# Altium project ATmega4809_Curiosity_Nano.PrjPcb
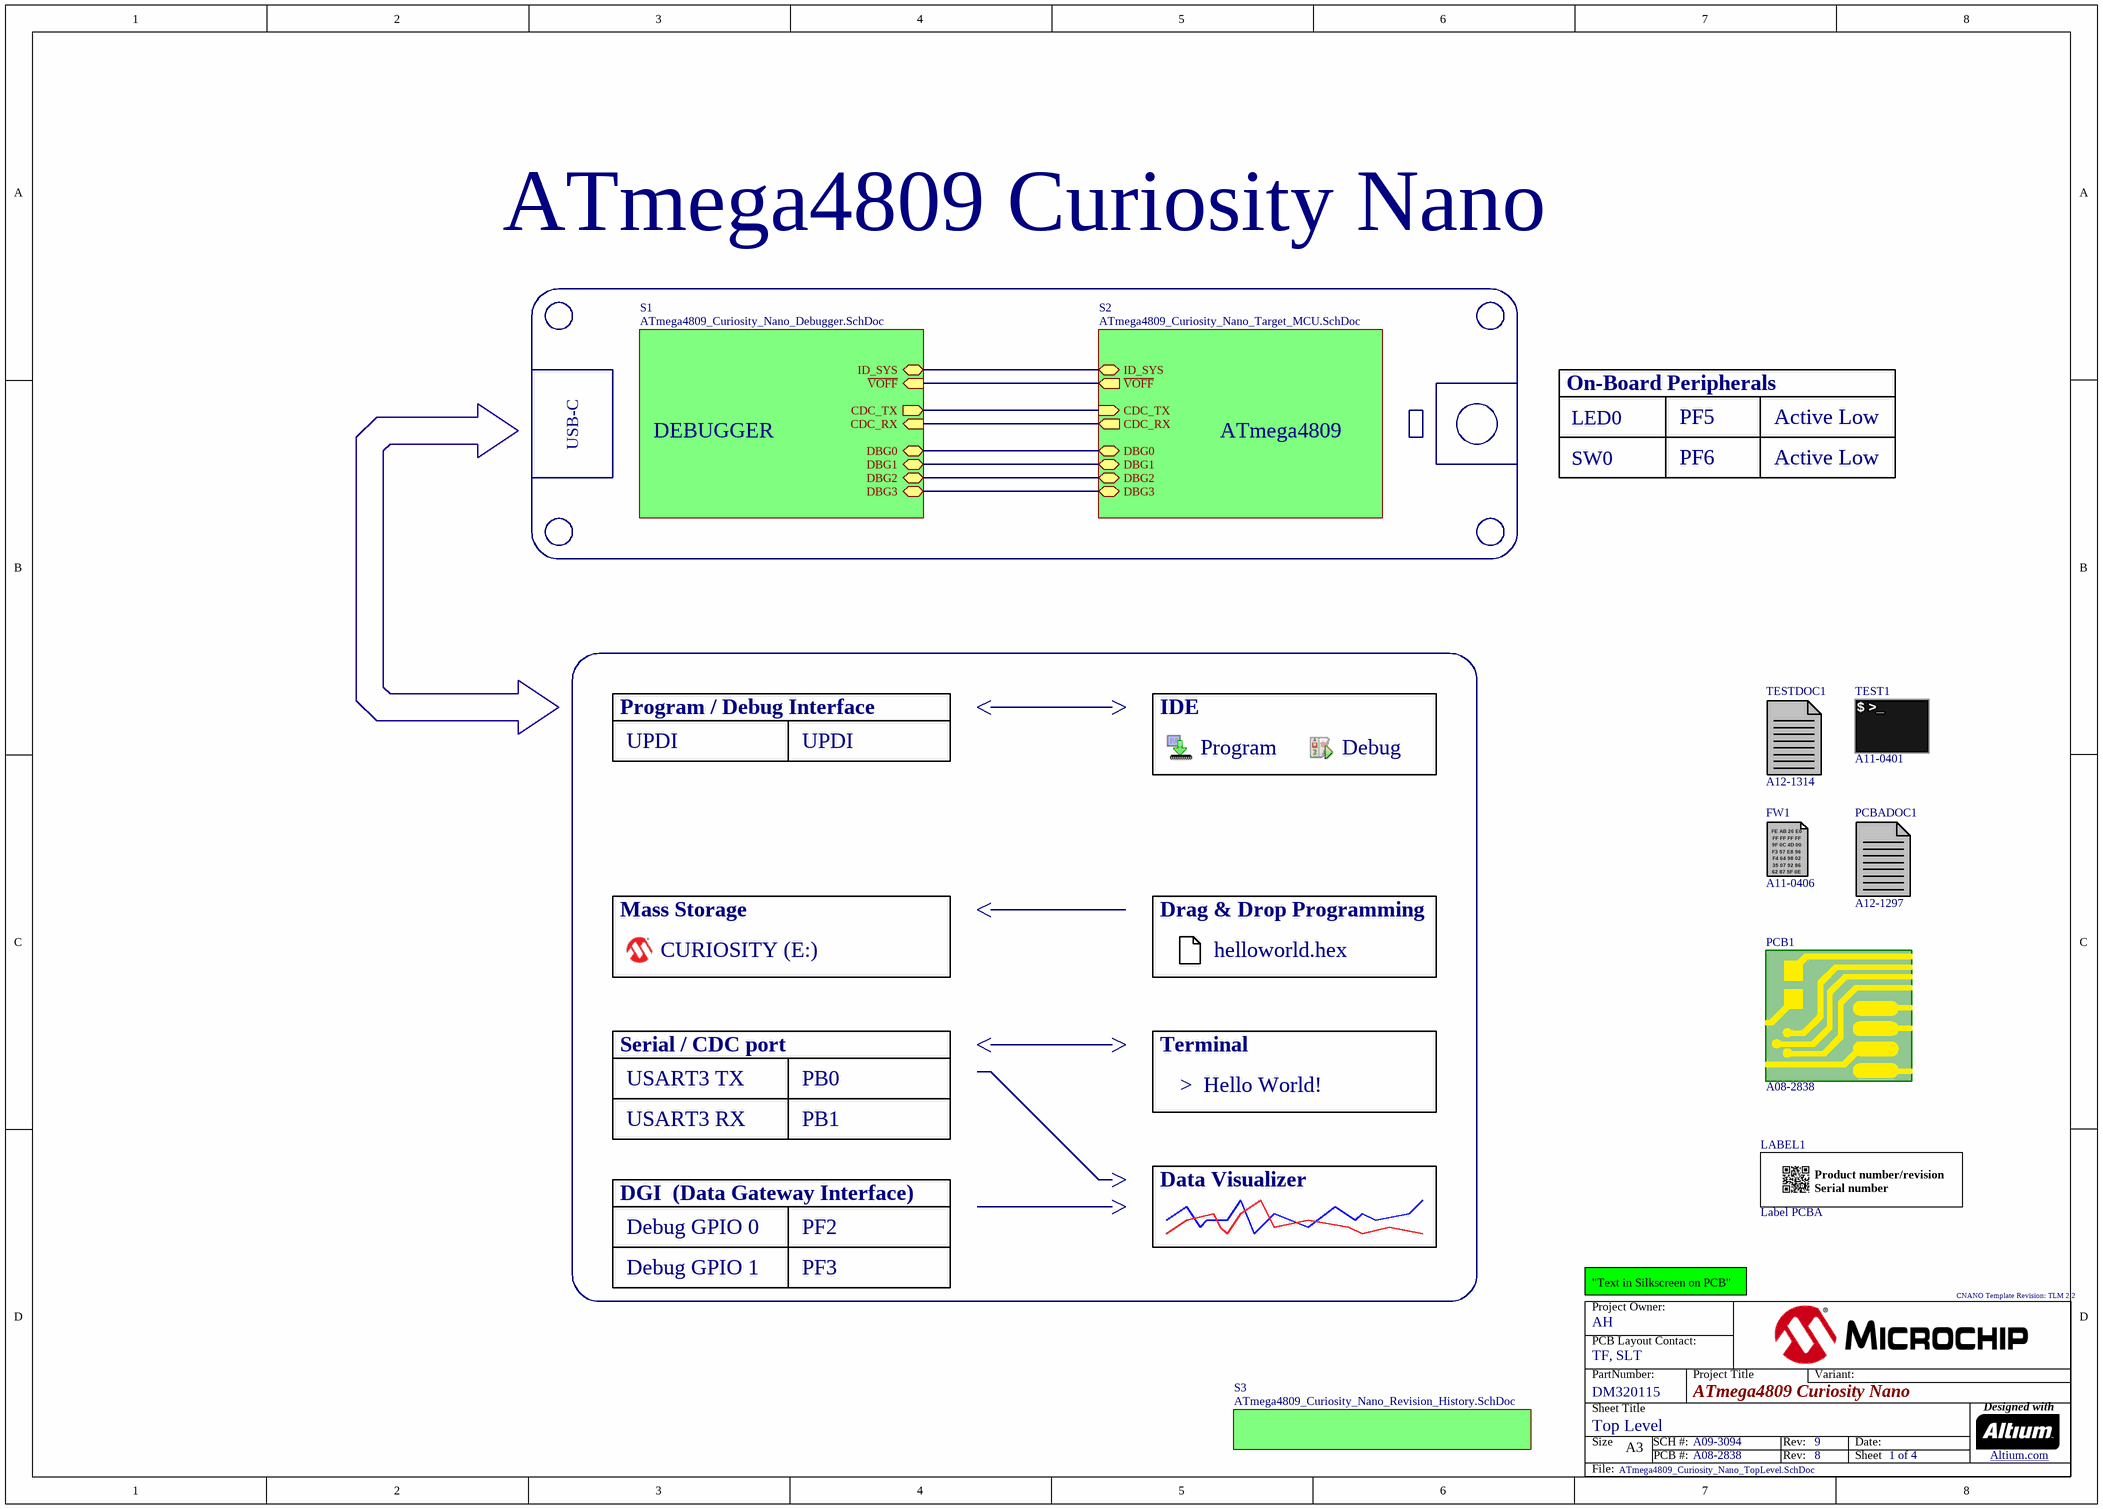
[diagram p0: ATmega4809_Curiosity_Nano_TopLevel.SchDoc]
CNANO_Template_Revision: TLM 2.2; OutjobTitle: ATmega4809-Curiosity-Nano; ProjectContactOwner: AH; ProjectContactPCB: TF, SLT; ProjectPartNumber: DM320115; ProjectPCBAssyNumber: A09-3094; ProjectPCBAssyRevision: 9; ProjectPCBFabNumber: A08-2838; ProjectPCBFabRevision: 8; ProjectTargetName: ATmega4809; ProjectTitle: ATmega4809 Curiosity Nano
4 sheets, 82 parts. Net scope: hierarchical (ports join the sheet entries above them; power ports are global).
Board file: ATmega4809_Curiosity_Nano.PcbDoc
Sheets:
  ATmega4809_Curiosity_Nano_TopLevel.SchDoc
    S2 = ATmega4809_Curiosity_Nano_Target_MCU.SchDoc
    S1 = ATmega4809_Curiosity_Nano_Debugger.SchDoc
    S3 = ATmega4809_Curiosity_Nano_Revision_History.SchDoc

## Sheet ATmega4809_Curiosity_Nano_TopLevel.SchDoc
size A3; SheetTitle: Top Level; CompanyName: Microchip Technology Inc.; Organization: Microchip Technology; Address1: 2355 West Chandler Blvd.; Address2: Chandler, AZ  85224; Address4: USA; SheetNumber: 1; SheetTotal: 4; Time: Time

### Parts
FW1  AN: A11-0406  (mechanical)
LABEL1  value Label PCBA  [AP8-00317]
PCB1  AN: A08-2838  (mechanical)
PCBADOC1  AN: A12-1297  (mechanical)
TEST1  AN: A11-0401  (mechanical)
TESTDOC1  AN: A12-1314  (mechanical)

### Sub-sheets
S1 = ATmega4809_Curiosity_Nano_Debugger.SchDoc: DBG2 (bidir), DBG1 (bidir), DBG3 (bidir), DBG0 (bidir), ~{VOFF} (in), ID_SYS (bidir), CDC_RX (in), CDC_TX (out)
S2 = ATmega4809_Curiosity_Nano_Target_MCU.SchDoc: DBG0 (bidir), DBG1 (bidir), DBG3 (bidir), DBG2 (bidir), ~{VOFF} (out), ID_SYS (bidir), CDC_RX (out), CDC_TX (in)
S3 = ATmega4809_Curiosity_Nano_Revision_History.SchDoc: no entries

### Nets
CDC_RX: sheet S2/CDC_RX, sheet S1/CDC_RX
CDC_TX: sheet S2/CDC_TX, sheet S1/CDC_TX
DBG0: sheet S2/DBG0, sheet S1/DBG0
DBG1: sheet S2/DBG1, sheet S1/DBG1
DBG2: sheet S2/DBG2, sheet S1/DBG2
DBG3: sheet S2/DBG3, sheet S1/DBG3
ID_SYS: sheet S2/ID_SYS, sheet S1/ID_SYS
~{VOFF}: sheet S2/~{VOFF}, sheet S1/~{VOFF}

### Notes on the sheet
- USB-C
- DEBUGGER
- On-Board Peripherals
- LED0
- PF5
- Active Low
- SW0
- PF6
- Program / Debug Interface
- IDE
- UPDI
- Program
- Debug
- Mass Storage
- Drag & Drop Programming
- CURIOSITY (E:)
- helloworld.hex
- Serial / CDC port
- Terminal
- USART3 TX
- USART3 RX
- PB1
- PB0
- >  Hello World!
- Data Visualizer
- DGI  (Data Gateway Interface)
- Debug GPIO 0
- PF2
- Debug GPIO 1
- PF3
- "Text in Silkscreen on PCB"
- Project Owner:
- PCB Layout Contact:
- PartNumber:
- Project Title
- Variant:
- Sheet Title
- Size
- A3
- SCH #:
- PCB #:
- Rev:
- Date:
- Sheet
- Designed with
- Altium.com <http://go.altium.com/MicrochipLandingPage_Evaluation.html>
- File:
- (in symbol A09-0611) / Product number/revision / Serial number
- (in symbol A11-0401) $ >_
- (in symbol A11-0406) FE AB 26 E0; FF FF FF FF; 9F 0C 4D 00; F3 57 E8 96; F4 64 98 02; 35 07 92 86; 62 87 5F 0E

### Library data of the parts
FW1 = A11-0406: nEDBG firmware; PartGroup: Software,Firmware,Tools; Value: nEDBG firmware
LABEL1 = A09-0611: PCBA identification label PP Top White Gloss; Manufacturer: ACT Logimark AS; MPN: 505462; PartGroup: Mechanical devices,Packaging materials,Printed Labels,PCBA; AN: A09-0611
PCB1 = A08-2838: ATmega4809 Curiosity Nano PCB documentation; PartGroup: Mechanical devices,Printed circuit boards; Value: ATmega4809 Curiosity Nano PCB documentation
PCBADOC1 = A12-1297: ATmega4809 Curiosity Nano PCBA documentation; PartGroup: Documentation,PCBA Documents,Atmel; Value: A09-3094 PCBA files
TEST1 = A11-0401: Fixture test for ATmega4809 Curiosity Nano; PartGroup: Software,Test software,Starter Kit; Value: ATmega4809 Curiosity Nano test
TESTDOC1 = A12-1314: Generic Test Instructions for Curiosity Nano; PartGroup: Documentation,Procedures,Test Instructions; Value: Curiosity Nano Test Instructions

## Sheet ATmega4809_Curiosity_Nano_Target_MCU.SchDoc
size A3; SheetTitle: Target MCU; CompanyName: Microchip Technology Inc.; Organization: Microchip Technology; Address1: 2355 West Chandler Blvd.; Address2: Chandler, AZ  85224; Address4: USA; SheetNumber: 2; SheetTotal: 4; Time: Time
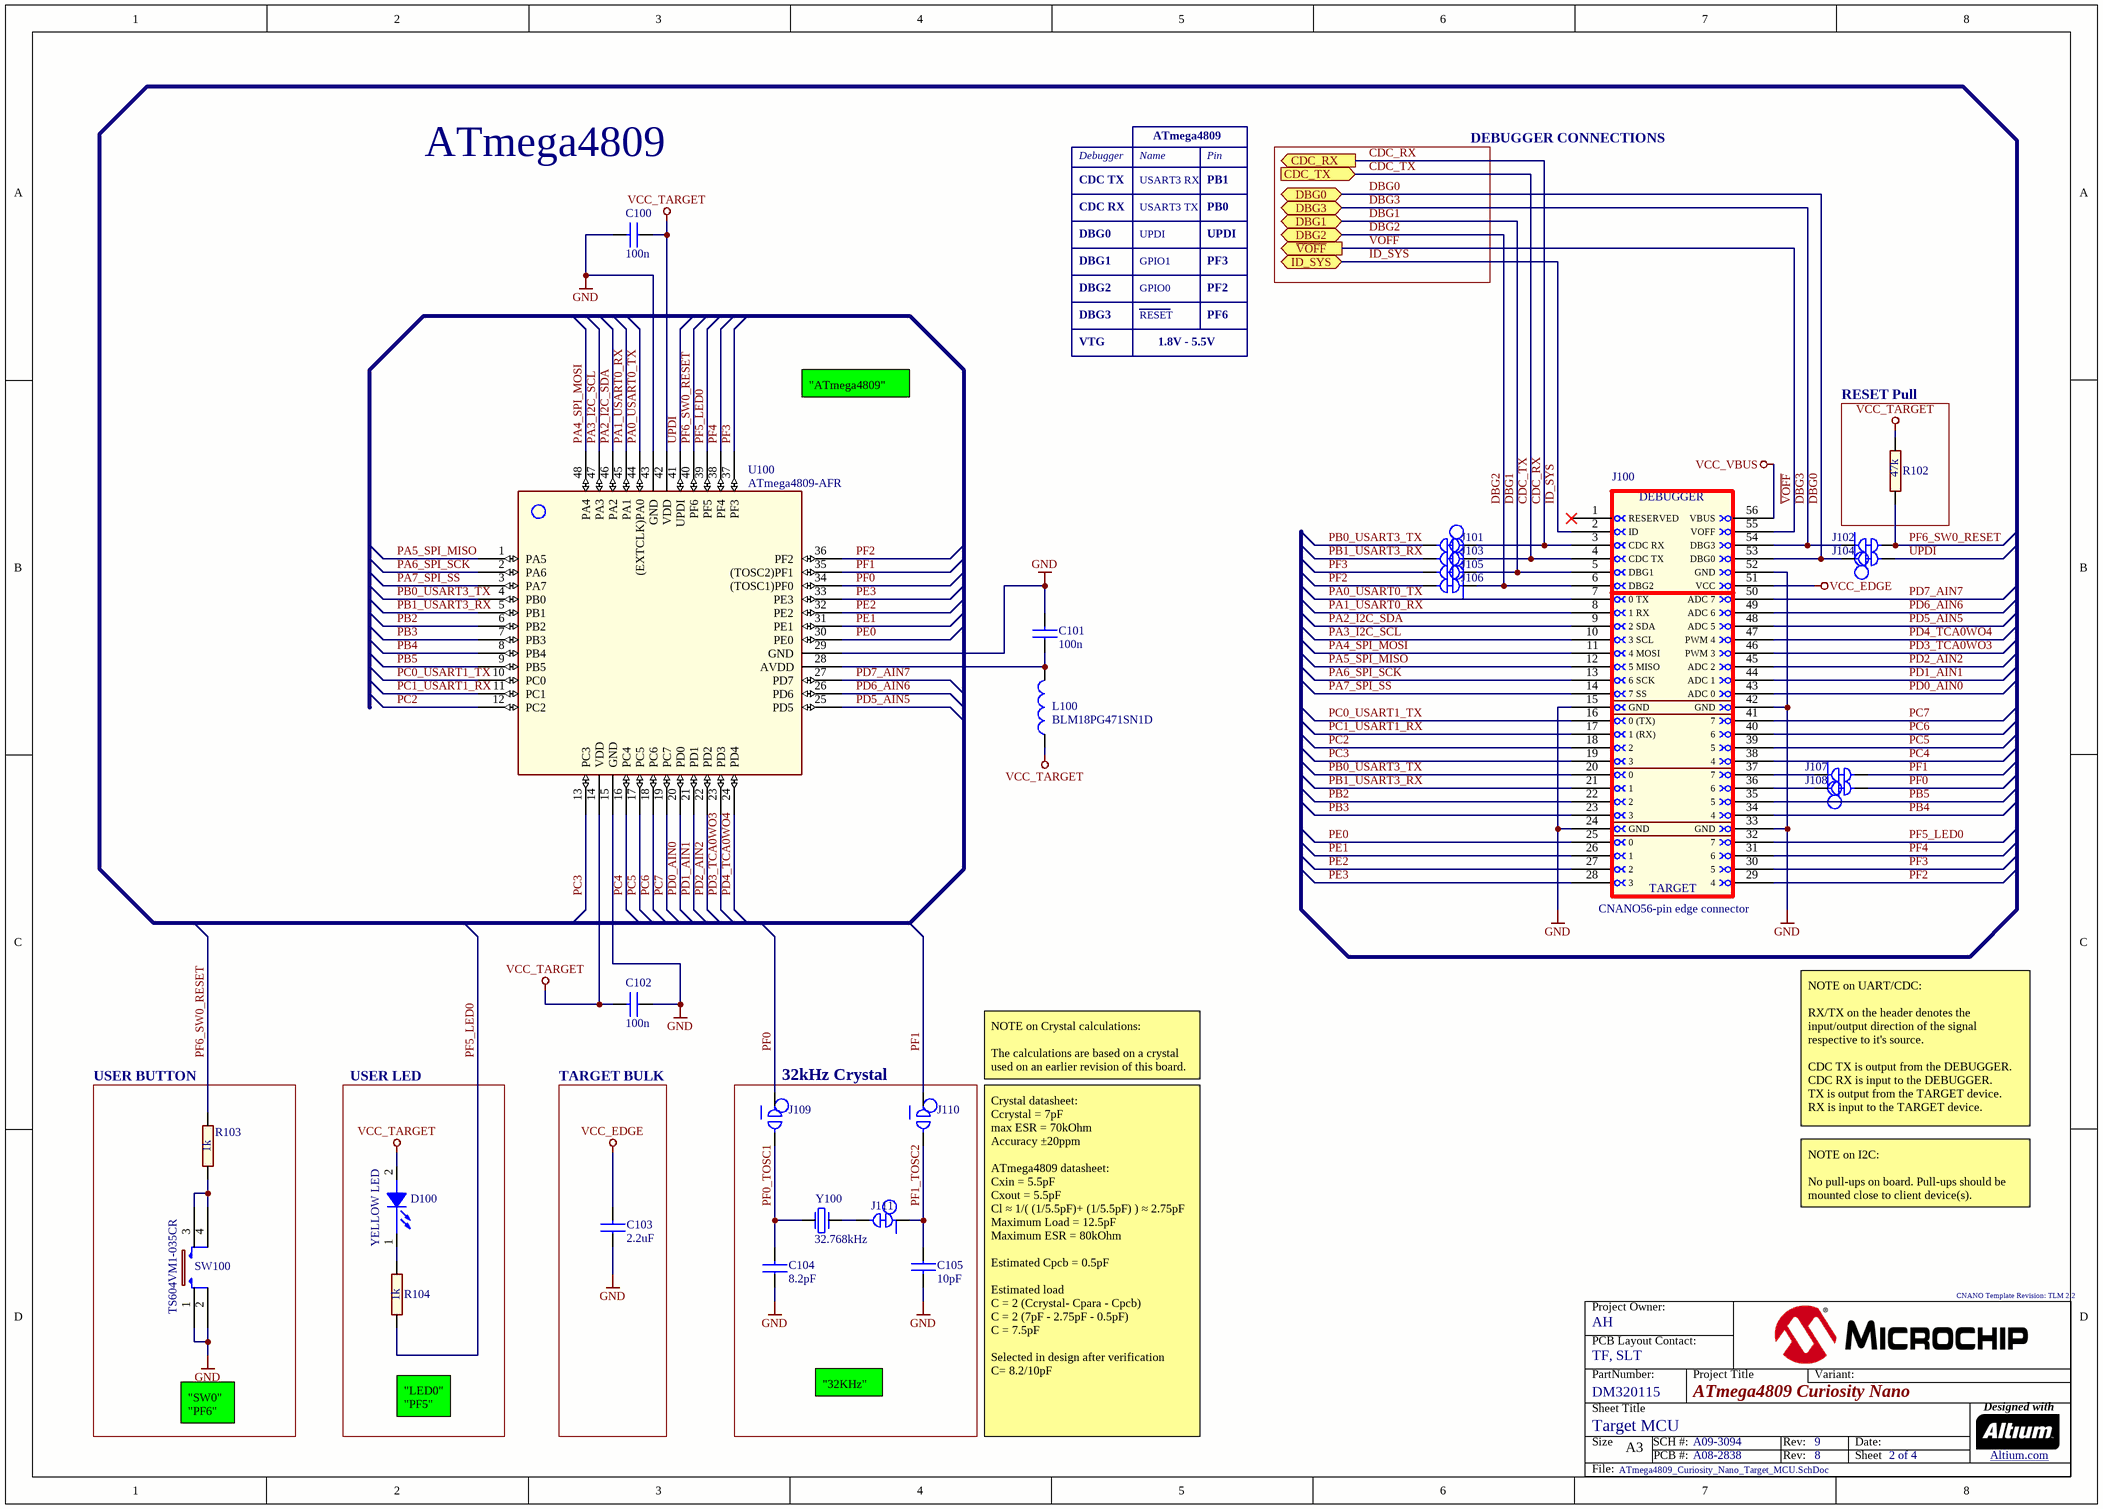
[diagram p1: ATmega4809_Curiosity_Nano_Target_MCU.SchDoc]

### Parts
C100  value 100n  [AP1-00148]
C101  value 100n  [AP1-00148]
C102  value 100n  [AP1-00148]
C103  value 2.2uF  [AP1-00148]
C104  value 8.2pF  [AP1-00141]  (hidden comment: RFA-C)
C105  value 10pF  [AP1-00038]
D100  value YELLOW LED  [AP4-00169]
J100  value CNANO56-pin edge connector  [AP8-01100]  (no BOM)
J101  (no value)  [AP8-01166]  (net tie, no BOM)
J102  (no value)  [AP8-01166]  (net tie, no BOM)
J103  (no value)  [AP8-01166]  (net tie, no BOM)
J104  (no value)  [AP8-01166]  (net tie, no BOM)
J105  (no value)  [AP8-01166]  (net tie, no BOM)
J106  (no value)  [AP8-01166]  (net tie, no BOM)
J107  (no value)  [AP8-01166]  (net tie, no BOM)
J108  (no value)  [AP8-01166]  (net tie, no BOM)
J109  (no value)  [AP9-00172]  (no BOM)
J110  (no value)  [AP9-00172]  (no BOM)
J111  (no value)  [AP8-00595]  (net tie, no BOM)
L100  value BLM18PG471SN1D  [AP3-00005]  (hidden comment: part number either has "D" (tape and reel) or "B" (Bulk) at the end.)
R102  value 47k  [AP2-00108]
R103  value 1k  [AP2-00108]
R104  value 1k  [AP2-00108]
SW100  value TS604VM1-035CR  [AP8-00137]  (hidden comment: Rating: DC 12V 50mA / Max 0.1 ohm contact resistance)
U100  value ATmega4809-AFR  [AP6-00357]
Y100  value 32.768kHz  [AP7-00069]

### Blocks framed on the sheet
RESET Pull: R102
USER BUTTON: R103 SW100
USER LED: D100 R104
TARGET BULK: C103
32kHz Crystal: C104 C105 J109-J111 Y100

### Ports
CDC_RX (out), CDC_TX (in), DBG0 (bidir), DBG1 (bidir), DBG2 (bidir), DBG3 (bidir), ID_SYS (bidir), ~{VOFF} (out)

### Nets
GND: C100.2 C101.2 C102.1 C103.1 C104.1 C105.2 J100.15(GND) J100.24(GND) J100.33(GND) J100.42(GND) J100.52(GND) SW100.1 SW100.2 U100.15(GND) U100.29(GND) U100.43(GND)
VCC_EDGE: C103.2 J100.51(VCC)
VCC_TARGET: C100.1 C102.2 D100.2(ANODE) L100.1 R102.2 U100.14(VDD) U100.42(VDD)
VCC_VBUS: J100.56(VBUS)
CDC_RX: J100.3(CDC_RX) J101.1 ; port CDC_RX
CDC_TX: J100.4(CDC_TX) J103.1 ; port CDC_TX
DBG0: J100.53(DBG0) J104.1 ; port DBG0
DBG1: J100.5(DBG1) J105.1 ; port DBG1
DBG2: J100.6(DBG2) J106.1 ; port DBG2
DBG3: J100.54(DBG3) J102.1 ; port DBG3
ID_SYS: J100.2(ID) ; port ID_SYS
PA0_USART0_TX: J100.7(0_TX) U100.44((EXTCLK)PA0)
PA1_USART0_RX: J100.8(1_RX) U100.45(PA1)
PA2_I2C_SDA: J100.9(2_SDA) U100.46(PA2)
PA3_I2C_SCL: J100.10(3_SCL) U100.47(PA3)
PA4_SPI_MOSI: J100.11(4_MOSI) U100.48(PA4)
PA5_SPI_MISO: J100.12(5_MISO) U100.1(PA5)
PA6_SPI_SCK: J100.13(6_SCK) U100.2(PA6)
PA7_SPI_SS: J100.14(7_SS) U100.3(PA7)
PB0_USART3_TX: J100.20(0) J101.2 U100.4(PB0)
PB1_USART3_RX: J100.21(1) J103.2 U100.5(PB1)
PB2: J100.22(2) U100.6(PB2)
PB3: J100.23(3) U100.7(PB3)
PB4: J100.34(4) U100.8(PB4)
PB5: J100.35(5) U100.9(PB5)
PC0_USART1_TX: J100.16(0_(TX)) U100.10(PC0)
PC1_USART1_RX: J100.17(1_(RX)) U100.11(PC1)
PC2: J100.18(2) U100.12(PC2)
PC3: J100.19(3) U100.13(PC3)
PC4: J100.38(4) U100.16(PC4)
PC5: J100.39(5) U100.17(PC5)
PC6: J100.40(6) U100.18(PC6)
PC7: J100.41(7) U100.19(PC7)
PD0_AIN0: J100.43(ADC_0) U100.20(PD0)
PD1_AIN1: J100.44(ADC_1) U100.21(PD1)
PD2_AIN2: J100.45(ADC_2) U100.22(PD2)
PD3_TCA0WO3: J100.46(PWM_3) U100.23(PD3)
PD4_TCA0WO4: J100.47(PWM_4) U100.24(PD4)
PD5_AIN5: J100.48(ADC_5) U100.25(PD5)
PD6_AIN6: J100.49(ADC_6) U100.26(PD6)
PD7_AIN7: J100.50(ADC_7) U100.27(PD7)
PE0: J100.25(0) U100.30(PE0)
PE1: J100.26(1) U100.31(PE1)
PE2: J100.27(2) U100.32(PE2)
PE3: J100.28(3) U100.33(PE3)
PF0: J108.2 J109.1 U100.34((TOSC1)PF0)
PF0_TOSC1: C104.2 J109.2 Y100.1
PF1: J107.2 J110.1 U100.35((TOSC2)PF1)
PF1_TOSC2: C105.1 J110.2 J111.1
PF2: J100.29(4) J106.2 U100.36(PF2)
PF3: J100.30(5) J105.2 U100.37(PF3)
PF4: J100.31(6) U100.38(PF4)
PF5_LED0: J100.32(7) R104.1 U100.39(PF5)
PF6_SW0_RESET: J102.2 R102.1 R103.1 U100.40(PF6)
UPDI: J104.2 U100.41(UPDI)
~{VOFF}: J100.55(VOFF) ; port ~{VOFF}
NetC101_1: C101.1 L100.2 U100.28(AVDD)
NetD100_1: D100.1(CATHODE) R104.2
NetJ100_36: J100.36(6) J108.1
NetJ100_37: J100.37(7) J107.1
NetJ111_2: J111.2 Y100.2
NetR103_2: R103.2 SW100.3 SW100.4

Not connected (* = marked no-connect by the designer): J100 1(RESERVED)*

### Notes on the sheet
- Debugger
- CDC TX
- USART3 RX
- Name
- PB1
- Pin
- DEBUGGER CONNECTIONS
- DBG0
- CDC RX
- UPDI
- USART3 TX
- PB0
- DBG1
- DBG2
- DBG3
- GPIO1
- GPIO0
- RESET
- PF3
- PF2
- PF6
- VTG
- 1.8V - 5.5V
- "ATmega4809"
- NOTE on Crystal calculations:
  The calculations are based on a crystal used on an earlier revision of this board.
- NOTE on UART/CDC:
  RX/TX on the header denotes the input/output direction of the signal respective to it's source.
  CDC TX is output from the DEBUGGER.
  CDC RX is input to the DEBUGGER.
  TX is output from the TARGET device.
  RX is input to the TARGET device.
- NOTE on I2C:
  No pull-ups on board. Pull-ups should be mounted close to client device(s).
- "32KHz"
- "SW0"
  "PF6"
- "LED0"
  "PF5"
- Crystal datasheet:
  Ccrystal = 7pF
  max ESR = 70kOhm
  Accuracy ±20ppm
  ATmega4809 datasheet:
  Cxin = 5.5pF
  Cxout = 5.5pF
  Cl ≈ 1/( (1/5.5pF)+ (1/5.5pF) ) ≈ 2.75pF
  Maximum Load = 12.5pF
  Maximum ESR = 80kOhm
  Estimated Cpcb = 0.5pF
  Estimated load
  C = 2 (Ccrystal- Cpara - Cpcb)
  C = 2 (7pF - 2.75pF - 0.5pF)
  C = 7.5pF
  Selected in design after verification
  C= 8.2/10pF
- Project Owner:
- PCB Layout Contact:
- PartNumber:
- Project Title
- Variant:
- Sheet Title
- Size
- A3
- SCH #:
- PCB #:
- Rev:
- Date:
- Sheet
- Designed with
- Altium.com <http://go.altium.com/MicrochipLandingPage_Evaluation.html>
- File:
- (in symbol A08-2840) DEBUGGER; TARGET

### Library data of the parts
C100-C102 = A01-0246: Ceramic capacitor, SMD 0402, X7R, 16V, +/-10%; PartGroup: Capacitors,Ceramic,SMD 0402; Manufacturer: Yageo; MPN: CC0402KRX7R7BB104; TemperatureRange: -55 - +125 deg C; Tolerance: 16V, +/-10%; AN: A01-0246; Height: 0.5
C103 = A01-0493: CAP CER 2.2UF 10V 10% X5R 0402; PartGroup: Capacitors,Ceramic,SMD 0402; Manufacturer: TDK; MPN: C1005X5R1A225K050BC; Tolerance: +/-10%; TemperatureRange: -55 to 85C; AN: A01-0493; Height: 0.5
C104 = A01-0803: 8.2pF GCQ15 Series HiQ Automotive 0402(EIA); PartGroup: Capacitors,Ceramic,SMD 0402; Manufacturer: Murata; MPN: GCQ1555C1H8R2D; Tolerance: +/-0.5; AN: A01-0803; Height: 0.5
C105 = A01-0356: Ceramic capacitor, SMD 0402, NP0, 50V, +/-5% (de16674); PartGroup: Capacitors,Ceramic,SMD 0402; Manufacturer: Yageo; MPN: CC0402JRNPO9BN100; Tolerance: 5%; TemperatureRange: -55 - +125 deg C; AN: A01-0356
D100 = A10-0218: LED, SMD 0603, Yellow, Wave length=590nm, 100mcd @ (20mA, 2.2Vf) rohm; PartGroup: Opto,LEDs,SMD; MPN: SML-D12Y1WT86; TemperatureRange: -40 to +85; AN: A10-0218; Height: 0.550000011920929; Manufacturer: ROHM
J100 = A08-2840: Curiosity Nano 56-pin edge connector with castellations, 100-mil pitch.; PartGroup: Mechanical devices,Connectors,Pin headers; AN: A08-2840
J101-J108 = A08-2981: Closed Link 0402 w/50mil hole; PartGroup: Mechanical devices,PCB implemented components; Value: Closed Link; AN: A08-2981
J109 J110 = A08-2866: 1x1mm, Round Strap, Open, no frame; PartGroup: Mechanical devices,PCB implemented components; Value: SOLDER-STRAP_OPEN; AN: A08-2866; Height: 0
J111 = A08-1454: Closed Link 0402; PartGroup: Mechanical devices,PCB implemented components; Value: Closed Link; AN: A08-1454
L100 = A03-0035: SMD RF inductor 0603. Z=470Ohm (@100MHz), Max R(dc)=0.20Ohm, Max current=1A; PartGroup: Inductors,EMI; Manufacturer: Murata; TemperatureRange: -55; AN: A03-0035; Height: 0.800000011920929; MPN: BLM18PG471SN1D
R102 = A02-0252: Thick film resistor, SMD 0402, 1/16W, 1%; PartGroup: Resistors,SMD,0402 1%; Manufacturer: KOA; MPN: RK73H1ETTP4702F; TemperatureRange: -55 - +125 deg C; Tolerance: 1 %; AN: A02-0252; Height: 0.349999994039536
R103 R104 = A02-0212: Thick film resistor, SMD 0402, 1/16W, 1%; PartGroup: Resistors,SMD,0402 1%; Manufacturer: Yageo; MPN: RC0402FR071KL; TemperatureRange: -55 - +125 deg C; Tolerance: 1 %; AN: A02-0212; Height: 0.349999994039536
SW100 = A08-2830: SWITCH, SMD, 260gf, 6.4mm X 6.2mm; PartGroup: Mechanical devices,Switches,SMD; Manufacturer: Dailywell Electronics Co.LTD; MPN: TS604VM1-035CR-R; TemperatureRange: -40 - +85 deg C; AN: A08-2830; Height: 3.5
U100 = A06-1553: Atmel 8-bit RISC MCU, 48K Flash, 48pin TQFP, 7x7mm, 0.5m pitch package; PartGroup: Integrated Circuits,MCU, MPU, DSP,AVR MCU; Manufacturer: Microchip; TemperatureRange: -40Â°C to +125Â°C; AN: A06-1553; MPN: ATmega4809-AFR
Y100 = A07-0171: Crystal, 32.768kHz, CL=9.0pF, ESR=70kOhm, SMD  LxW=3.2 x 1.5mm, 20ppm; PartGroup: Frequency devices,Crystals,SMD; Manufacturer: Microchip; MPN: VMK3-9001-32K7680000TR; TemperatureRange: -40 to 85C; AN: A07-0171; Tolerance: 20ppm; Height: 0.899999976158142

## Sheet ATmega4809_Curiosity_Nano_Debugger.SchDoc
size A3; SheetTitle: Debugger; CompanyName: Microchip Technology Inc.; Organization: Microchip Technology; Address1: 2355 West Chandler Blvd.; Address2: Chandler, AZ  85224; Address4: USA; SheetNumber: 3; SheetTotal: 4; Time: Time
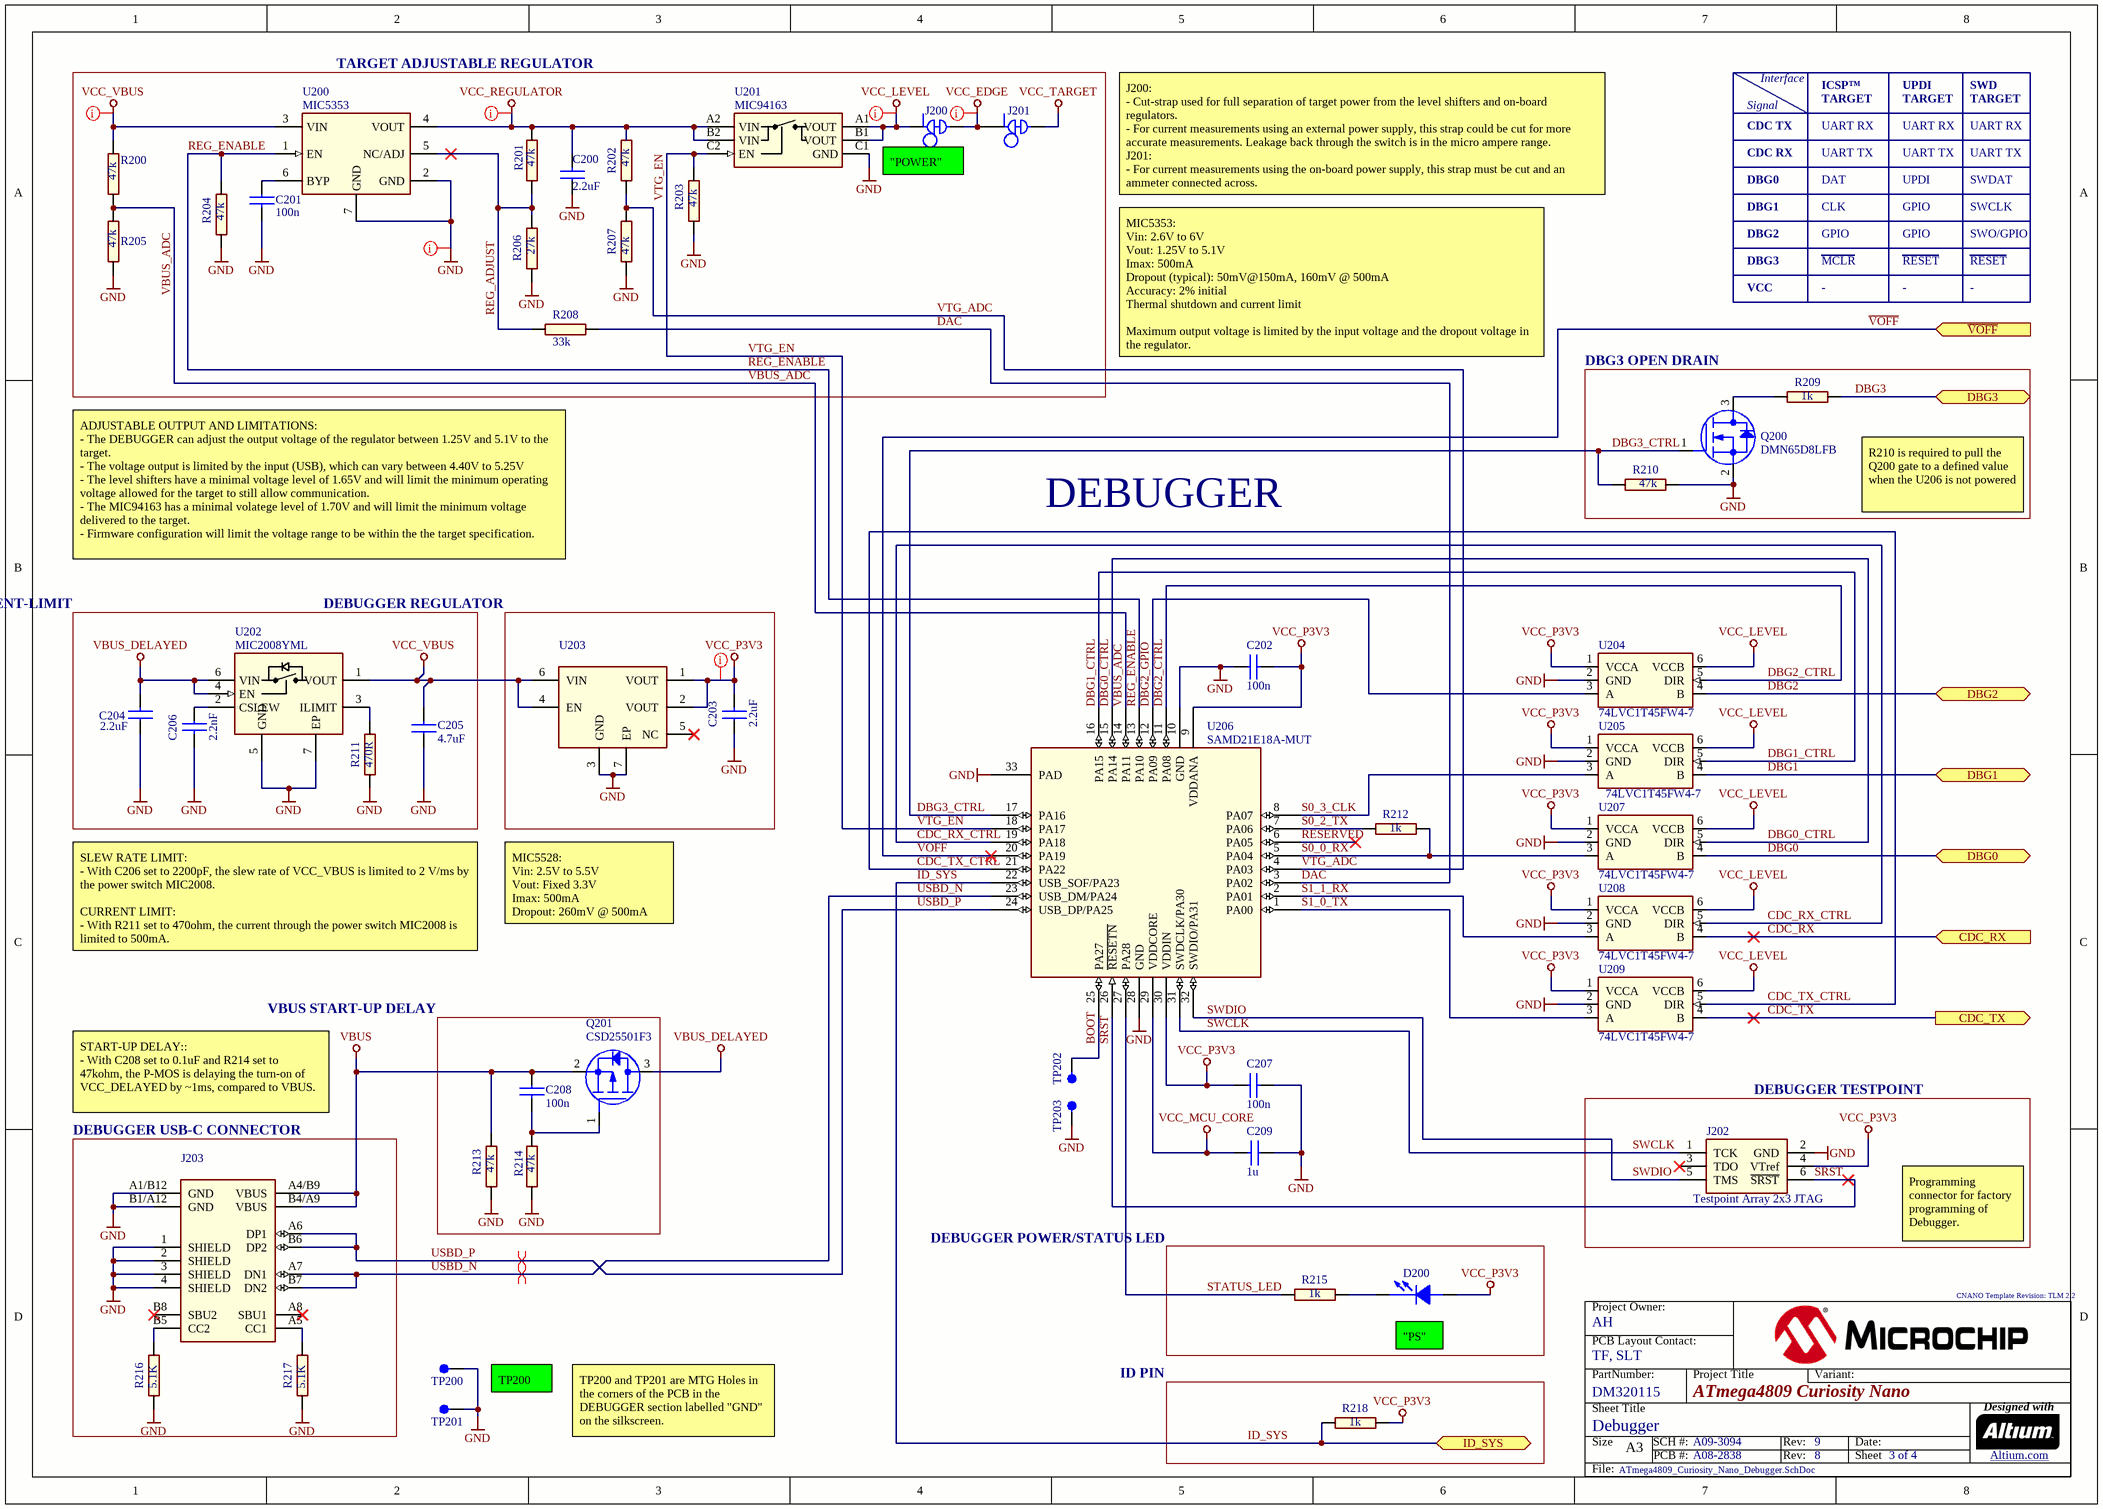
[diagram p2: ATmega4809_Curiosity_Nano_Debugger.SchDoc]

### Parts
C200  value 2.2uF  [AP1-00148]
C201  value 100n  [AP1-00148]
C202  value 100n  [AP1-00148]
C203  value 2.2uF  [AP1-00148]
C204  value 2.2uF  [AP1-00148]
C205  value 4.7uF  [AP1-00039]
C206  value 2.2nF  [AP1-00148]
C207  value 100n  [AP1-00148]
C208  value 100n  [AP1-00148]
C209  value 1u  [AP1-00148]
D200  (no value)  [AP4-00160]
J200  (no value)  [AP8-00595]  (net tie, no BOM)
J201  (no value)  [AP8-01183]  (net tie, no BOM)
J202  value Testpoint Array 2x3 JTAG  [AP8-01249]  (no BOM)
J203  (no value)  [AP8-01248]
Q200  value DMN65D8LFB  [AP5-00056]
Q201  value CSD25501F3  [AP5-00062]
R200  value 47k  [AP2-00108]
R201  value 47k  [AP2-00108]
R202  value 47k  [AP2-00108]
R203  value 47k  [AP2-00108]
R204  value 47k  [AP2-00108]
R205  value 47k  [AP2-00108]
R206  value 27k  [AP2-00108]
R207  value 47k  [AP2-00108]
R208  value 33k  [AP2-00108]
R209  value 1k  [AP2-00108]
R210  value 47k  [AP2-00108]
R211  value 470R  [AP2-00108]
R212  value 1k  [AP2-00108]
R213  value 47k  [AP2-00108]
R214  value 47k  [AP2-00108]
R215  value 1k  [AP2-00108]
R216  value 5.1K  [AP2-00108]
R217  value 5.1K  [AP2-00108]
R218  value 1k  [AP2-00108]
TP200  PCB implemented component.  [AP8-01250]  (value not drawn)  (no BOM)
TP201  PCB implemented component.  [AP8-01250]  (value not drawn)  (no BOM)
TP202  PCB implemented component.  [AP8-00870]  (value not drawn)  (no BOM)
TP203  PCB implemented component.  [AP8-00870]  (value not drawn)  (no BOM)
U200  value MIC5353  [AP6-00504]  (hidden comment: Marking code: AAR)
U201  value MIC94163  [AP6-00513]
U202  value MIC2008YML  [AP6-00576]
U203  (no value)  [AP6-00481]
U204  value 74LVC1T45FW4-7  [AP6-00575]
U205  value 74LVC1T45FW4-7  [AP6-00575]
U206  value SAMD21E18A-MUT  [AP6-00418]  (hidden comment: QFN32)
U207  value 74LVC1T45FW4-7  [AP6-00575]
U208  value 74LVC1T45FW4-7  [AP6-00575]
U209  value 74LVC1T45FW4-7  [AP6-00575]

### Blocks framed on the sheet
TARGET ADJUSTABLE REGULATOR: C200 C201 J200 J201 R200-R208 U200 U201
DBG3 OPEN DRAIN: Q200 R209 R210
VBUS SLEW RATE- & CURRENT-LIMIT: C204-C206 R211 U202
DEBUGGER REGULATOR: C203 U203
VBUS START-UP DELAY: C208 Q201 R213 R214
DEBUGGER TESTPOINT: J202
DEBUGGER USB-C CONNECTOR: J203 R216 R217
DEBUGGER POWER/STATUS LED: D200 R215
ID PIN: R218

### Ports
CDC_RX (in), CDC_TX (out), DBG0 (bidir), DBG1 (bidir), DBG2 (bidir), DBG3 (bidir), ID_SYS (bidir), ~{VOFF} (in)

### Nets
GND: C200.1 C201.2 C202.1 C203.1 C204.1 C205.1 C206.2 C207.2 C209.1 J202.2(GND) J203.1(SHIELD) J203.2(SHIELD) J203.3(SHIELD) J203.4(SHIELD) J203.A1/B12(GND) J203.B1/A12(GND) Q200.2(S) R203.2 R204.2 R205.1 R206.1 R207.1 R210.2 R211.2 R213.2 R214.2 R216.2 R217.2 TP200.1 TP201.1 TP203.1 U200.2(GND) U200.7(GND) U201.C1(GND) U202.5(GND) U202.7(EP) U203.3(GND) U203.7(EP) U204.2(GND) U205.2(GND) U206.10(GND) U206.28(GND) U206.33(PAD) U207.2(GND) U208.2(GND) U209.2(GND)
VBUS: C208.1 J203.A4/B9(VBUS) J203.B4/A9(VBUS) Q201.2(S) R213.1
VBUS_DELAYED: C204.2 Q201.3(D) U202.4(EN) U202.6(VIN)
VCC_EDGE: J200.2 J201.1
VCC_LEVEL: J200.1 U201.A1(VOUT) U201.B1(VOUT) U204.6(VCCB) U205.6(VCCB) U207.6(VCCB) U208.6(VCCB) U209.6(VCCB)
VCC_MCU_CORE: C209.2 U206.29(VDDCORE)
VCC_P3V3: C202.2 C203.2 C207.1 D200.2(ANODE) J202.4(VTref) R218.2 U203.1(VOUT) U203.2(VOUT) U204.1(VCCA) U205.1(VCCA) U206.9(VDDANA) U206.30(VDDIN) U207.1(VCCA) U208.1(VCCA) U209.1(VCCA)
VCC_REGULATOR: C200.2 R201.1 R202.2 U200.4(VOUT) U201.A2(VIN) U201.B2(VIN)
VCC_TARGET: J201.2
VCC_VBUS: C205.2 R200.1 U200.3(VIN) U202.1(VOUT) U203.4(EN) U203.6(VIN)
BOOT: TP202.1 U206.25(PA27)
CDC_RX: U208.4(B) ; port CDC_RX
CDC_RX_CTRL: U206.19(PA18) U208.5(DIR)
CDC_TX: U209.4(B) ; port CDC_TX
CDC_TX_CTRL: U206.21(PA22) U209.5(DIR)
DAC: R208.2 U206.3(PA02)
DBG0: U207.4(B) ; port DBG0
DBG0_CTRL: U206.15(PA14) U207.5(DIR)
DBG1: U205.4(B) ; port DBG1
DBG1_CTRL: U205.5(DIR) U206.16(PA15)
DBG2: U204.4(B) ; port DBG2
DBG2_CTRL: U204.5(DIR) U206.11(PA08)
DBG2_GPIO: U204.3(A) U206.12(PA09)
DBG3: R209.2 ; port DBG3
DBG3_CTRL: Q200.1(G) R210.1 U206.17(PA16)
ID_SYS: R218.1 U206.22(USB_SOF/PA23) ; port ID_SYS
REG_ADJUST: R201.2 R206.2 R208.1 U200.5(NC/ADJ)
REG_ENABLE: R204.1 U200.1(EN) U206.13(PA10)
RESERVED: U206.6(PA05)
S0_0_RX: R212.1 U206.5(PA04) U207.3(A)
S0_2_TX: R212.2 U206.7(PA06)
S0_3_CLK: U205.3(A) U206.8(PA07)
S1_0_TX: U206.1(PA00) U209.3(A)
S1_1_RX: U206.2(PA01) U208.3(A)
~{SRST}: J202.6(~{SRST}) U206.26(~{RESETN})
STATUS_LED: R215.2 U206.27(PA28)
SWCLK: J202.1(TCK) U206.31(SWDCLK/PA30)
SWDIO: J202.5(TMS) U206.32(SWDIO/PA31)
USBD_N: J203.A7(DN1) J203.B7(DN2) U206.23(USB_DM/PA24)
USBD_P: J203.A6(DP1) J203.B6(DP2) U206.24(USB_DP/PA25)
~{VOFF}: U206.20(PA19) ; port ~{VOFF}
VBUS_ADC: R200.2 R205.2 U206.14(PA11)
VTG_ADC: R202.1 R207.2 U206.4(PA03)
VTG_EN: R203.1 U201.C2(EN) U206.18(PA17)
NetC201_1: C201.1 U200.6(BYP)
NetC206_1: C206.1 U202.2(CSLEW)
NetC208_2: C208.2 Q201.1(G) R214.1
NetD200_1: D200.1(CATHODE) R215.1
NetJ203_A5: J203.A5(CC1) R217.1
NetJ203_B5: J203.B5(CC2) R216.1
NetQ200_3: Q200.3(D) R209.1
NetR211_1: R211.1 U202.3(ILIMIT)

Not connected (* = marked no-connect by the designer): J202 3(TDO)*; J203 A8(SBU1)* B8(SBU2)*; U203 5(NC)*

### Layout directives
net class Power: GND, VCC_EDGE, VCC_LEVEL, VCC_P3V3, VCC_REGULATOR, VCC_VBUS
differential pair: USBD_N, USBD_P

### Notes on the sheet
- Signal
- Interface
- ICSP™
- TARGET
- UPDI
- SWD
- (near J200) "POWER"
- CDC TX
- CDC RX
- DBG0
- UART RX
- UART TX
- DAT
- SWDAT
- J200:
  - Cut-strap used for full separation of target power from the level shifters and on-board regulators.
  - For current measurements using an external power supply, this strap could be cut for more accurate measurements. Leakage back through the switch is in the micro ampere range.
  J201:
  - For current measurements using the on-board power supply, this strap must be cut and an ammeter connected across.
- DBG1
- DBG2
- CLK
- GPIO
- SWCLK
- SWO/GPIO
- DBG3
- VCC
- MCLR
- -
- RESET
- MIC5353:
  Vin: 2.6V to 6V
  Vout: 1.25V to 5.1V
  Imax: 500mA
  Dropout (typical): 50mV@150mA, 160mV @ 500mA
  Accuracy: 2% initial
  Thermal shutdown and current limit
  Maximum output voltage is limited by the input voltage and the dropout voltage in the regulator.
  (Vmax = Vin - dropout)
- DEBUGGER
- (near R209) R210 is required to pull the Q200 gate to a defined value when the U206 is not powered
- ADJUSTABLE OUTPUT AND LIMITATIONS:
  - The DEBUGGER can adjust the output voltage of the regulator between 1.25V and 5.1V to the target.
  - The voltage output is limited by the input (USB), which can vary between 4.40V to 5.25V
  - The level shifters have a minimal voltage level of 1.65V and will limit the minimum operating voltage allowed for the target to still allow communication.
  - The MIC94163 has a minimal volatege level of 1.70V and will limit the minimum voltage delivered to the target.
  - Firmware configuration will limit the voltage range to be within the the target specification.
- MIC5528:
  Vin: 2.5V to 5.5V
  Vout: Fixed 3.3V
  Imax: 500mA
  Dropout: 260mV @ 500mA
- SLEW RATE LIMIT:
  - With C206 set to 2200pF, the slew rate of VCC_VBUS is limited to 2 V/ms by the power switch MIC2008.
  CURRENT LIMIT:
  - With R211 set to 470ohm, the current through the power switch MIC2008 is limited to 500mA.
- START-UP DELAY::
  - With C208 set to 0.1uF and R214 set to 47kohm, the P-MOS is delaying the turn-on of VCC_DELAYED by ~1ms, compared to VBUS.
- Programming connector for factory programming of Debugger.
- TP200 and TP201 are MTG Holes in the corners of the PCB in the DEBUGGER section labelled "GND" on the silkscreen.
- (near D200) "PS"
- Project Owner:
- PCB Layout Contact:
- PartNumber:
- Project Title
- Variant:
- Sheet Title
- Size
- A3
- SCH #:
- PCB #:
- Rev:
- Date:
- Sheet
- Designed with
- Altium.com <http://go.altium.com/MicrochipLandingPage_Evaluation.html>
- File:

### Library data of the parts
C200 C203 C204 = A01-0493: as C103 on sheet ATmega4809_Curiosity_Nano_Target_MCU; AN: A01-0493; Height: 0.5
C201 C202 C207 C208 = A01-0246: as C100 on sheet ATmega4809_Curiosity_Nano_Target_MCU; Tolerance: 16V, +/-10%; AN: A01-0246; Height: 0.5
C205 = A01-0377: Ceramic capacitor, SMD 0603, X5R, 10V, 10% (de31036); PartGroup: Capacitors,Ceramic,SMD 0603; Manufacturer: Yageo; MPN: CC0603KRX5R6BB475; TemperatureRange: -55 - +85 deg C; Tolerance: 10%; AN: A01-0377; Height: 0.800000011920929
C206 = A01-0918: Ceramic capacitor, SMD 0402, C0G, 25V, +/-5%; PartGroup: Capacitors,Ceramic,SMD 0402; Manufacturer: Kemet; MPN: C0402C222J3GACTU; TemperatureRange: -55C to +125C; Tolerance: 25V, +/-5%; AN: A01-0918; Height: 0.5
C209 = A01-0286: Ceramic capacitor, SMD 0402, X5R, 6.3V, +/-10% (de26942); PartGroup: Capacitors,Ceramic,SMD 0402; Manufacturer: Kemet; MPN: C0402C105K9PAC; TemperatureRange: -55 to 85 deg C; Tolerance: +/-10%; AN: A01-0286; Height: 0.5
D200 = A10-0213: LED, SMD 0402, Green, Wave length=569nm, 2.1mcd @ (1mA, 1.9Vf)rohm; PartGroup: Opto,LEDs,SMD; MPN: SML-P12MTT86R; Value: GREEN LED; TemperatureRange: -40 to +85; AN: A10-0213; Height: 0.200000002980232; Manufacturer: ROHM
J200 = A08-1454: as J111 on sheet ATmega4809_Curiosity_Nano_Target_MCU; Value: Closed Link; AN: A08-1454
J201 = A08-3029: Closed Link with w/hole for 1x2 100mil header; PartGroup: Mechanical devices,PCB implemented components; Value: Closed Link 1x2 100mil header; AN: A08-3029
J202 = A08-3186: 6-pin Testpoint Array, 0.8mm Pad, 1.27mm Pitch; PartGroup: Mechanical devices,PCB implemented components,PCB plane connectors; AN: A08-3186; Height: 0
J203 = A08-3185: USB2.0 Type-C, Surface mount signals and DIP shield; PartGroup: Mechanical devices,Connectors,USB; Manufacturer: Cabcon A/S; Value: L-KLS1-5409-R; TemperatureRange: -30 to 85C; AN: A08-3185; Height: 3.16000008583069; MPN: L-KLS1-5409-R
Q200 = A05-0180: N-channel MOSFET, DFN1006-3 (SOT883), 60V, 330mA, 4Ohm; PartGroup: Transistors,Small signal FET,SMD; Manufacturer: Diodes Incorporated; MPN: DMN65D8LFB-7; TemperatureRange: -55Â°C to +150Â°C; AN: A05-0180
Q201 = A05-0209: P-Channel MOSFET, LGA, 20V, 3.6A, 76mOhm; PartGroup: Transistors,Small signal FET,SMD; Manufacturer: Texas Instruments; TemperatureRange: -55 to 150C; AN: A05-0209; Height: 0.200000002980232; MPN: CSD25501F3
R200-R205 R207 R210 R213 R214 = A02-0252: as R102 on sheet ATmega4809_Curiosity_Nano_Target_MCU; Tolerance: 1 %; AN: A02-0252; Height: 0.349999994039536
R206 = A02-0246: Thick film resistor, SMD 0402, 1/16W, 1%; PartGroup: Resistors,SMD,0402 1%; Manufacturer: Yageo; MPN: RC0402FR-0727KL; TemperatureRange: -55 - +125 deg C; Tolerance: 1 %; AN: A02-0246; Height: 0.349999994039536
R208 = A02-0248: Thick film resistor, SMD 0402, 1/16W, 1%; PartGroup: Resistors,SMD,0402 1%; Manufacturer: Yageo; MPN: RC0402FR-0733KL; TemperatureRange: -55 - +125 deg C; Tolerance: 1 %; AN: A02-0248; Height: 0.349999994039536
R209 R212 R215 R218 = A02-0212: as R103 on sheet ATmega4809_Curiosity_Nano_Target_MCU; Tolerance: 1 %; AN: A02-0212; Height: 0.349999994039536
R211 = A02-0946: Thick film resistror, SMD 0402, 1/16W, 1%; PartGroup: Resistors,SMD,0402 1%; Manufacturer: Yageo; MPN: RC0402FR-07470RL; TemperatureRange: â€“55 to +155 deg C; Tolerance: 1%; AN: A02-0946; Height: 0.349999994039536
R216 R217 = A02-1244: Thick film resistor, SMD 0402, 1W, 1%; PartGroup: Resistors,SMD,0402 1%; Manufacturer: Panasonic; MPN: ERJ-2RKF5101X; TemperatureRange: -55C to +125C; Tolerance: 1%; AN: A02-1244; Height: 0.349999994039536
TP200 TP201 = A08-3187: TH Test point - D3.6H2.7; PartGroup: Mechanical devices,Connectors,Test points; Value: TH Test point - D3.6H2.7; AN: A08-3187; Height: 0
TP202 TP203 = A08-2176: SMD Test point - 0.8mm; PartGroup: Mechanical devices,Connectors,Test points; Value: SMD Test point - 0.8mm; AN: A08-2176; Height: 0
U200 = A06-1578: 500mA Ultra Low Dropout LDO regulator, 2% accuracy, 1.6x1.6mm MLF; PartGroup: Integrated Circuits,Regulators,Linear; Manufacturer: Microchip; MPN: MIC5353YMT-TR; TemperatureRange: -40Â°C to +125Â°C; AN: A06-1578; Height: 0.899999976158142
U201 = A06-1613: Loadswitch, Rds(on) = 14.5mohm, 1.0mm x 1.5mm WLCSP, reverse blocking; PartGroup: Integrated Circuits,General linear,Analog switch, bus switch and MUX; Manufacturer: Microchip; MPN: MIC94163YCS-TR; TemperatureRange: -40Â°C to +125Â°C; AN: A06-1613; Height: 0.800000011920929
U202 = A06-1826: 0.2A- 2.5A adjustable current limit power switch, 2mm x 2mm DFN; PartGroup: Integrated Circuits,General linear,Analog switch, bus switch and MUX; Manufacturer: Microchip; MPN: MIC2008YML-TR; TemperatureRange: -40C to +85C; AN: A06-1826; Height: 0.850000023841858
U203 = A06-1475: LDO 3.3V 0.5A 6TDFN; PartGroup: Integrated Circuits,Regulators,Linear; Manufacturer: Microchip; MPN: MIC5528-3.3YMT-T5; Value: MIC5528-3.3YMT; TemperatureRange: -40Â°C ~ 125Â°C; AN: A06-1475; Design Comment: *; Height: 0.550000011920929
U204 U205 U207-U209 = A06-1580: Single-Bit Dual-Supply Transceive, 1.65-5.5 Translation and 3-State Outputs; PartGroup: Integrated Circuits,Interface ICs,Level translators; Manufacturer: Diodes Incorporated; TemperatureRange: -40C - 125C; AN: A06-1580; Height: 0.400000005960464; MPN: 74LVC1T45FW4-7
U206 = A06-1205: 32-bit RISC MCU 32pin; PartGroup: Integrated Circuits,MCU, MPU, DSP,ARM MCU; Manufacturer: Microchip; MPN: ATSAMD21E18A-MUT; TemperatureRange: -40Â°C to +85Â°C; AN: A06-1205; Height: 1.20000004768372

## Sheet ATmega4809_Curiosity_Nano_Revision_History.SchDoc
size A3; SheetTitle: Revision History; CompanyName: Microchip Technology Inc.; Organization: Microchip Technology; Address1: 2355 West Chandler Blvd.; Address2: Chandler, AZ  85224; Address4: USA; SheetNumber: 4; SheetTotal: 4; Time: Time
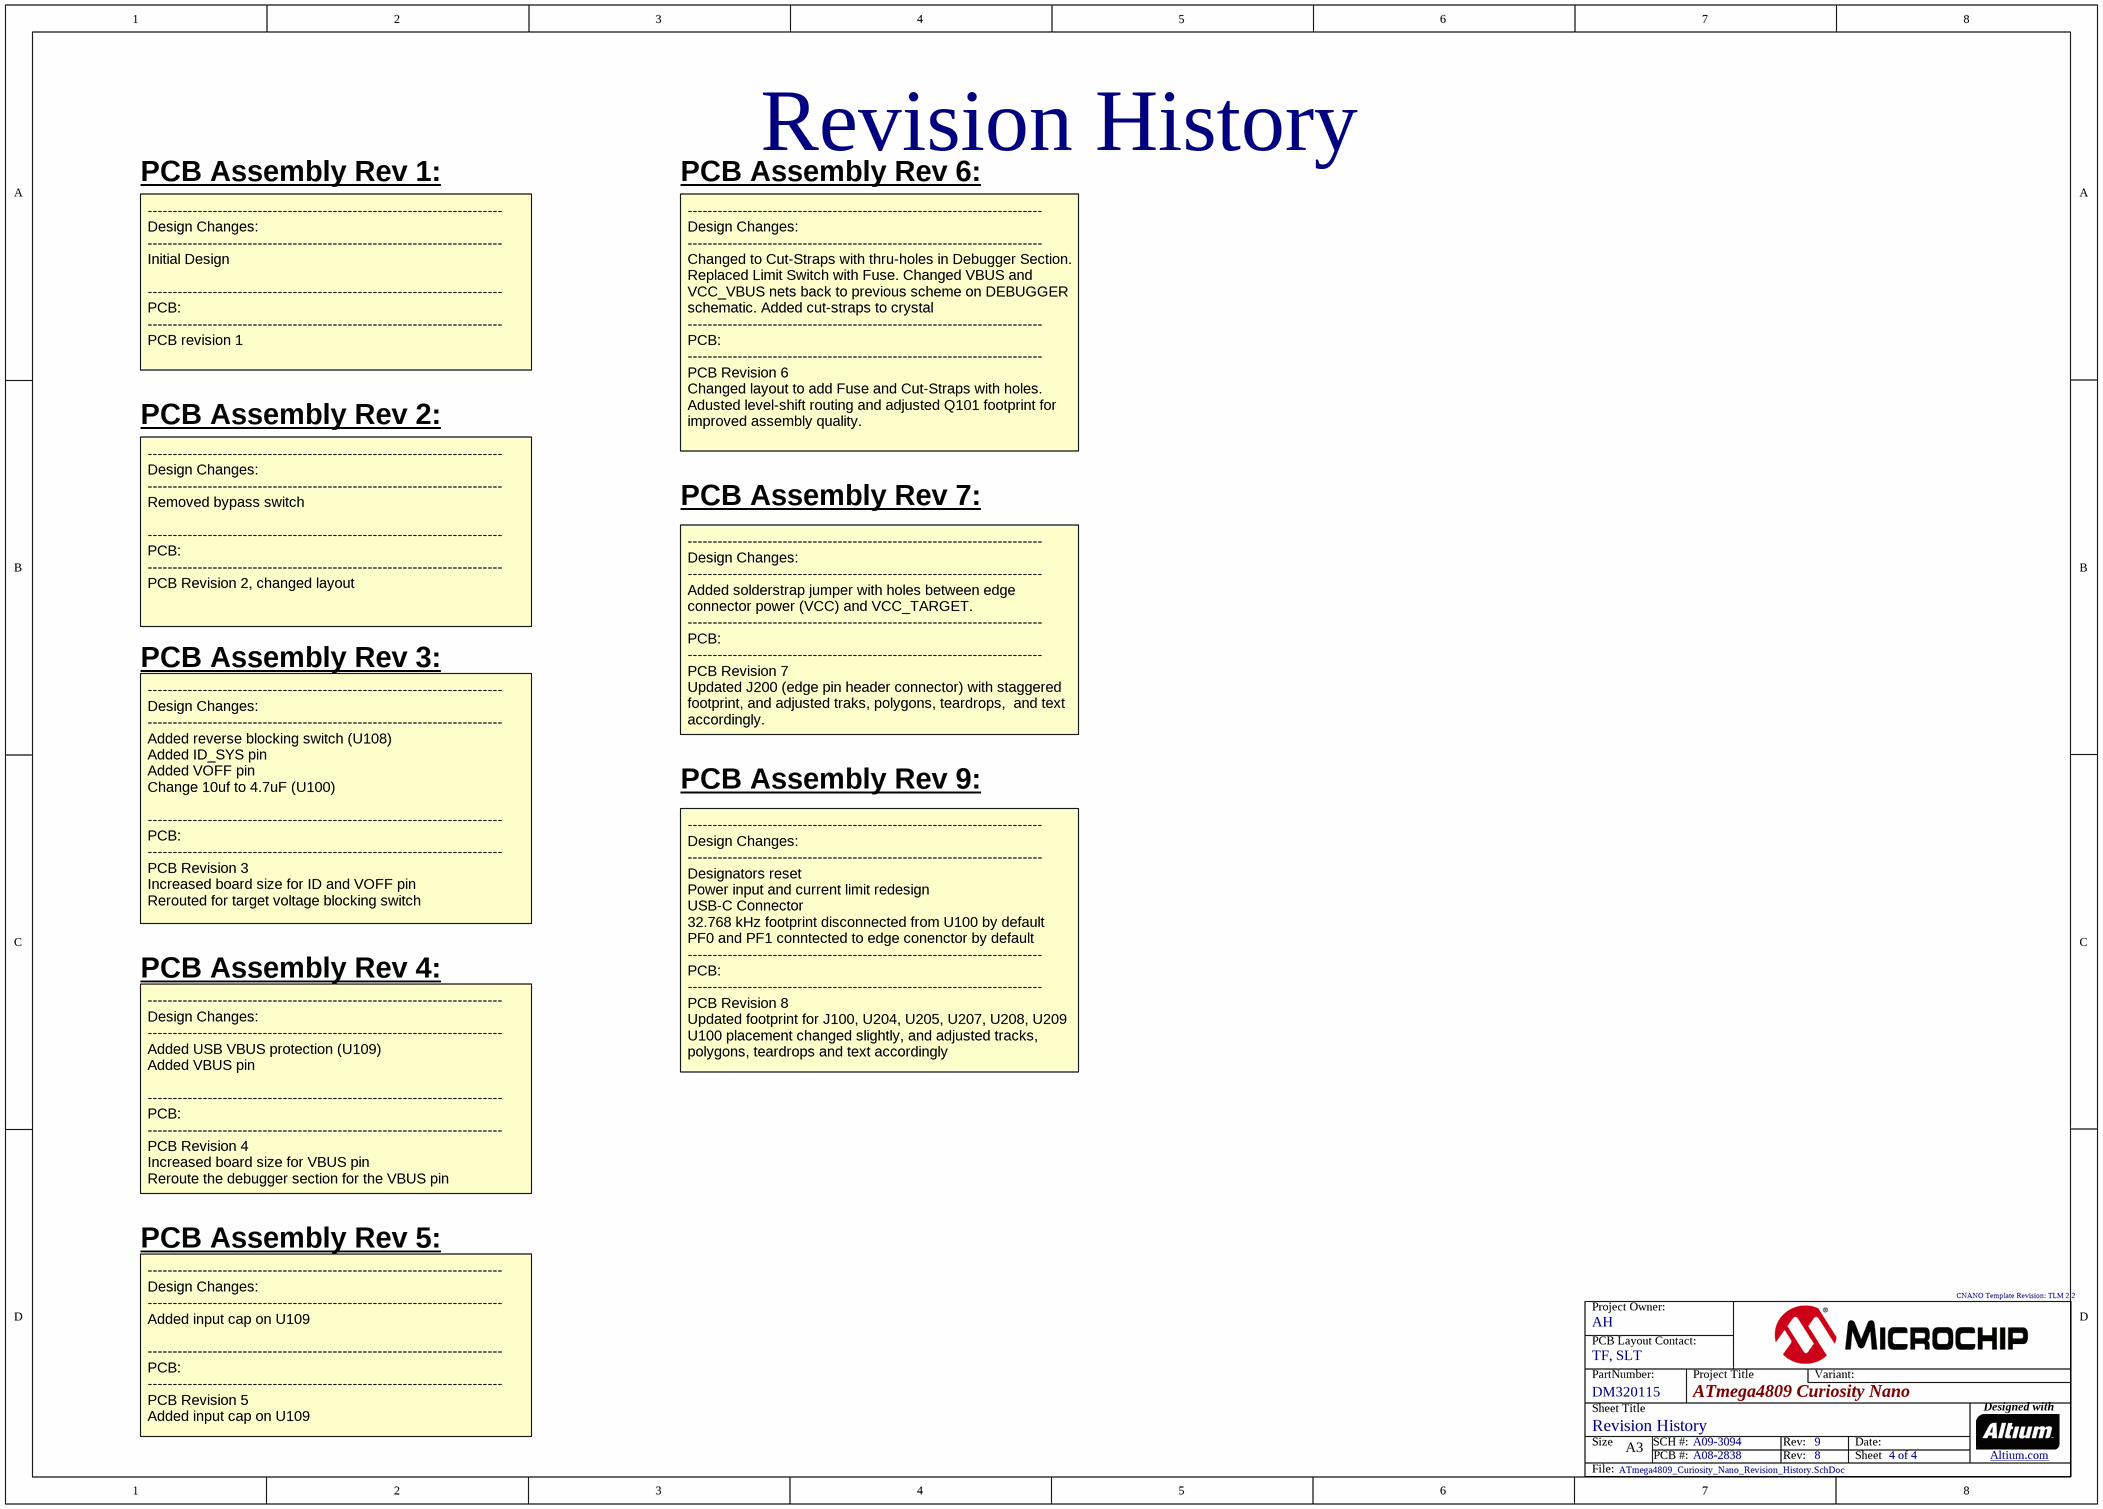
[diagram p3: ATmega4809_Curiosity_Nano_Revision_History.SchDoc]

### Notes on the sheet
- Revision History
- PCB Assembly Rev 1:
- PCB Assembly Rev 6:
- -----------------------------------------------------------------------
  Design Changes:
  -----------------------------------------------------------------------
  Initial Design
  -----------------------------------------------------------------------
  PCB:
  -----------------------------------------------------------------------
  PCB revision 1
- PCB Assembly Rev 2:
- -----------------------------------------------------------------------
  Design Changes:
  -----------------------------------------------------------------------
  Changed to Cut-Straps with thru-holes in Debugger Section.
  Replaced Limit Switch with Fuse. Changed VBUS and VCC_VBUS nets back to previous scheme on DEBUGGER schematic. Added cut-straps to crystal
  -----------------------------------------------------------------------
  PCB:
  -----------------------------------------------------------------------
  PCB Revision 6
  Changed layout to add Fuse and Cut-Straps with holes. Adusted level-shift routing and adjusted Q101 footprint for improved assembly quality.
- PCB Assembly Rev 7:
- -----------------------------------------------------------------------
  Design Changes:
  -----------------------------------------------------------------------
  Removed bypass switch
  -----------------------------------------------------------------------
  PCB:
  -----------------------------------------------------------------------
  PCB Revision 2, changed layout
- PCB Assembly Rev 3:
- -----------------------------------------------------------------------
  Design Changes:
  -----------------------------------------------------------------------
  Added solderstrap jumper with holes between edge connector power (VCC) and VCC_TARGET.
  -----------------------------------------------------------------------
  PCB:
  -----------------------------------------------------------------------
  PCB Revision 7
  Updated J200 (edge pin header connector) with staggered footprint, and adjusted traks, polygons, teardrops,  and text accordingly.
- PCB Assembly Rev 9:
- -----------------------------------------------------------------------
  Design Changes:
  -----------------------------------------------------------------------
  Added reverse blocking switch (U108)
  Added ID_SYS pin
  Added VOFF pin
  Change 10uf to 4.7uF (U100)
  -----------------------------------------------------------------------
  PCB:
  -----------------------------------------------------------------------
  PCB Revision 3
  Increased board size for ID and VOFF pin
  Rerouted for target voltage blocking switch
- PCB Assembly Rev 4:
- -----------------------------------------------------------------------
  Design Changes:
  -----------------------------------------------------------------------
  Designators reset
  Power input and current limit redesign
  USB-C Connector
  32.768 kHz footprint disconnected from U100 by default
  PF0 and PF1 conntected to edge conenctor by default
  -----------------------------------------------------------------------
  PCB:
  -----------------------------------------------------------------------
  PCB Revision 8
  Updated footprint for J100, U204, U205, U207, U208, U209
  U100 placement changed slightly, and adjusted tracks, polygons, teardrops and text accordingly
- -----------------------------------------------------------------------
  Design Changes:
  -----------------------------------------------------------------------
  Added USB VBUS protection (U109)
  Added VBUS pin
  -----------------------------------------------------------------------
  PCB:
  -----------------------------------------------------------------------
  PCB Revision 4
  Increased board size for VBUS pin
  Reroute the debugger section for the VBUS pin
- PCB Assembly Rev 5:
- -----------------------------------------------------------------------
  Design Changes:
  -----------------------------------------------------------------------
  Added input cap on U109
  -----------------------------------------------------------------------
  PCB:
  -----------------------------------------------------------------------
  PCB Revision 5
  Added input cap on U109
- Project Owner:
- PCB Layout Contact:
- PartNumber:
- Project Title
- Variant:
- Sheet Title
- Size
- A3
- SCH #:
- PCB #:
- Rev:
- Date:
- Sheet
- Designed with
- Altium.com <http://go.altium.com/MicrochipLandingPage_Evaluation.html>
- File:

## Nets that join several sheets
GND: ATmega4809_Curiosity_Nano_Target_MCU (16 pins), ATmega4809_Curiosity_Nano_Debugger (46 pins)
VCC_EDGE: ATmega4809_Curiosity_Nano_Target_MCU (C103.2 J100.51), ATmega4809_Curiosity_Nano_Debugger (J200.2 J201.1)
VCC_TARGET: ATmega4809_Curiosity_Nano_Target_MCU (7 pins), ATmega4809_Curiosity_Nano_Debugger (J201.2)
VCC_VBUS: ATmega4809_Curiosity_Nano_Target_MCU (J100.56), ATmega4809_Curiosity_Nano_Debugger (6 pins)
CDC_RX: ATmega4809_Curiosity_Nano_Target_MCU (J100.3 J101.1), ATmega4809_Curiosity_Nano_Debugger (U208.4)
CDC_TX: ATmega4809_Curiosity_Nano_Target_MCU (J100.4 J103.1), ATmega4809_Curiosity_Nano_Debugger (U209.4)
DBG0: ATmega4809_Curiosity_Nano_Target_MCU (J100.53 J104.1), ATmega4809_Curiosity_Nano_Debugger (U207.4)
DBG1: ATmega4809_Curiosity_Nano_Target_MCU (J100.5 J105.1), ATmega4809_Curiosity_Nano_Debugger (U205.4)
DBG2: ATmega4809_Curiosity_Nano_Target_MCU (J100.6 J106.1), ATmega4809_Curiosity_Nano_Debugger (U204.4)
DBG3: ATmega4809_Curiosity_Nano_Target_MCU (J100.54 J102.1), ATmega4809_Curiosity_Nano_Debugger (R209.2)
ID_SYS: ATmega4809_Curiosity_Nano_Target_MCU (J100.2), ATmega4809_Curiosity_Nano_Debugger (R218.1 U206.22)
~{VOFF}: ATmega4809_Curiosity_Nano_Target_MCU (J100.55), ATmega4809_Curiosity_Nano_Debugger (U206.20)

## Assembly variants
Default Assembly: not fitted C203 C204 Y200